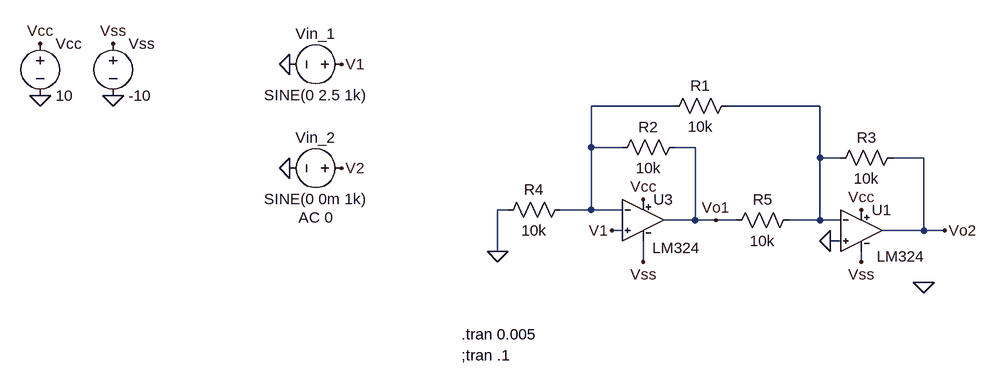
[diagram p0: schematic Circuito1.asc]
Circuito1.asc, the LTspice schematic file:
Version 4
SHEET 1 880 680
WIRE 144 -32 16 -32
WIRE 368 -32 224 -32
WIRE 16 32 16 -32
WIRE 64 32 16 32
WIRE 176 32 144 32
WIRE 368 48 368 -32
WIRE 400 48 368 48
WIRE 528 48 480 48
WIRE -112 128 -128 128
WIRE 16 128 16 32
WIRE 16 128 -32 128
WIRE 64 128 16 128
WIRE 176 144 176 32
WIRE 176 144 128 144
WIRE 208 144 176 144
WIRE 240 144 208 144
WIRE 368 144 368 48
WIRE 368 144 320 144
WIRE 400 144 368 144
WIRE 64 160 48 160
WIRE 528 160 528 48
WIRE 528 160 464 160
WIRE 560 160 528 160
WIRE 400 176 384 176
WIRE -128 192 -128 128
WIRE 96 208 96 176
WIRE 432 208 432 192
FLAG -128 192 0
FLAG 528 240 0
FLAG 96 208 Vss
FLAG 432 208 Vss
FLAG -720 -128 Vss
FLAG -832 -128 Vcc
FLAG 96 112 Vcc
FLAG 432 128 Vcc
FLAG -368 -96 V1
FLAG 48 160 V1
FLAG -368 64 V2
FLAG -832 -48 0
FLAG -720 -48 0
FLAG -448 -96 0
FLAG -448 64 0
FLAG 560 160 Vo2
FLAG 208 144 Vo1
FLAG 384 176 0
SYMBOL res -16 112 R90
WINDOW 0 0 56 VBottom 2
WINDOW 3 32 56 VTop 2
SYMATTR InstName R4
SYMATTR Value 10k
SYMBOL res 160 16 R90
WINDOW 0 0 56 VBottom 2
WINDOW 3 32 56 VTop 2
SYMATTR InstName R2
SYMATTR Value 10k
SYMBOL res 240 -48 R90
WINDOW 0 0 56 VBottom 2
WINDOW 3 32 56 VTop 2
SYMATTR InstName R1
SYMATTR Value 10k
SYMBOL res 336 128 R90
WINDOW 0 0 56 VBottom 2
WINDOW 3 32 56 VTop 2
SYMATTR InstName R5
SYMATTR Value 10k
SYMBOL res 496 32 R90
WINDOW 0 0 56 VBottom 2
WINDOW 3 32 56 VTop 2
SYMATTR InstName R3
SYMATTR Value 10k
SYMBOL voltage -352 -96 R90
WINDOW 0 -32 56 VBottom 2
WINDOW 3 32 56 VTop 2
WINDOW 123 -4 56 VBottom 2
WINDOW 39 0 0 Left 0
SYMATTR InstName Vin_1
SYMATTR Value SINE(0 2.5 1k)
SYMBOL voltage -832 -144 R0
WINDOW 123 0 0 Left 0
WINDOW 39 0 0 Left 0
SYMATTR InstName Vcc
SYMATTR Value 10
SYMBOL voltage -720 -144 R0
WINDOW 123 0 0 Left 0
WINDOW 39 0 0 Left 0
SYMATTR InstName Vss
SYMATTR Value -10
SYMBOL voltage -352 64 R90
WINDOW 0 -32 56 VBottom 2
WINDOW 3 32 56 VTop 2
WINDOW 123 60 56 VTop 2
WINDOW 39 0 0 Left 0
SYMATTR InstName Vin_2
SYMATTR Value SINE(0 0m 1k)
SYMATTR Value2 AC 0
SYMBOL AutoGenerated\\LM324 96 144 R0
WINDOW 3 51 27 Top 2
SYMATTR InstName U3
SYMBOL AutoGenerated\\LM324 432 160 R0
WINDOW 3 61 24 Top 2
SYMATTR InstName U1
TEXT -184 352 Left 2 !;tran .1
TEXT -184 320 Left 2 !.tran 0.005

The netlist it stands for:
* Circuito1.asc
R4 N001 0 10k
R2 Vo1 N001 10k
R1 N002 N001 10k
R5 N002 Vo1 10k
R3 Vo2 N002 10k
Vin_1 V1 0 SINE(0 2.5 1k)
Vcc Vcc 0 10
Vss Vss 0 -10
Vin_2 V2 0 SINE(0 0m 1k) AC 0
XU3 V1 N001 Vcc Vss Vo1 LM324  ; pins In+ In- V+ V- OUT
XU1 0 N002 Vcc Vss Vo2 LM324  ; pins In+ In- V+ V- OUT
;tran .1
.tran 0.005
.lib E:\LtSpice_components\LM324.ti.lib
.backanno
.end